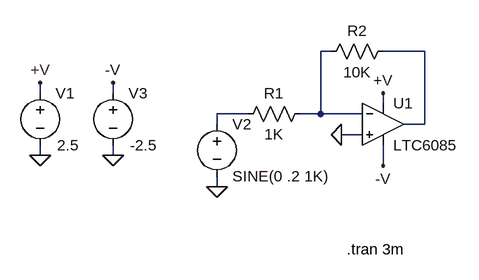
[diagram p0: schematic 6085.asc]
6085.asc, the LTspice schematic file:
Version 4
SHEET 1 880 680
WIRE 128 80 112 80
WIRE 272 80 208 80
WIRE -320 144 -320 128
WIRE -208 144 -208 128
WIRE 208 160 208 144
WIRE 0 176 -48 176
WIRE 112 176 112 80
WIRE 112 176 80 176
WIRE 176 176 112 176
WIRE -48 192 -48 176
WIRE 272 192 272 80
WIRE 272 192 240 192
WIRE 176 208 144 208
WIRE -320 240 -320 224
WIRE -208 240 -208 224
WIRE 208 256 208 224
WIRE -48 288 -48 272
FLAG -320 240 0
FLAG -48 288 0
FLAG 208 144 +V
FLAG -320 128 +V
FLAG 144 208 0
FLAG -208 240 0
FLAG -208 128 -V
FLAG 208 256 -V
SYMBOL voltage -320 128 R0
WINDOW 3 26 96 Left 2
SYMATTR Value 2.5
SYMATTR InstName V1
SYMBOL voltage -48 176 R0
WINDOW 123 0 0 Left 2
WINDOW 39 0 0 Left 2
SYMATTR InstName V2
SYMATTR Value SINE(0 .2 1K)
SYMBOL res 96 160 R90
WINDOW 0 0 56 VBottom 2
WINDOW 3 32 56 VTop 2
SYMATTR InstName R1
SYMATTR Value 1K
SYMBOL res 224 64 R90
WINDOW 0 0 56 VBottom 2
WINDOW 3 32 56 VTop 2
SYMATTR InstName R2
SYMATTR Value 10K
SYMBOL voltage -208 128 R0
WINDOW 3 26 96 Left 2
SYMATTR Value -2.5
SYMATTR InstName V3
SYMBOL LTC6085 208 192 R0
SYMATTR InstName U1
TEXT 152 384 Left 2 !.tran 3m

The netlist it stands for:
* 6085.asc
V1 +V 0 2.5
V2 N003 0 SINE(0 .2 1K)
R1 N001 N003 1K
R2 N002 N001 10K
V3 -V 0 -2.5
* U1: LTC6085 (symbol LTC6085 not available, pins judged from their places): In+=0 In-=N001 V+=+V V-=-V OUT=N002
.tran 3m
.backanno
.end